# EAGLE schematic ATtiny85 and DRV8830 Combo -- v01 (EAGLE 6.5.0)
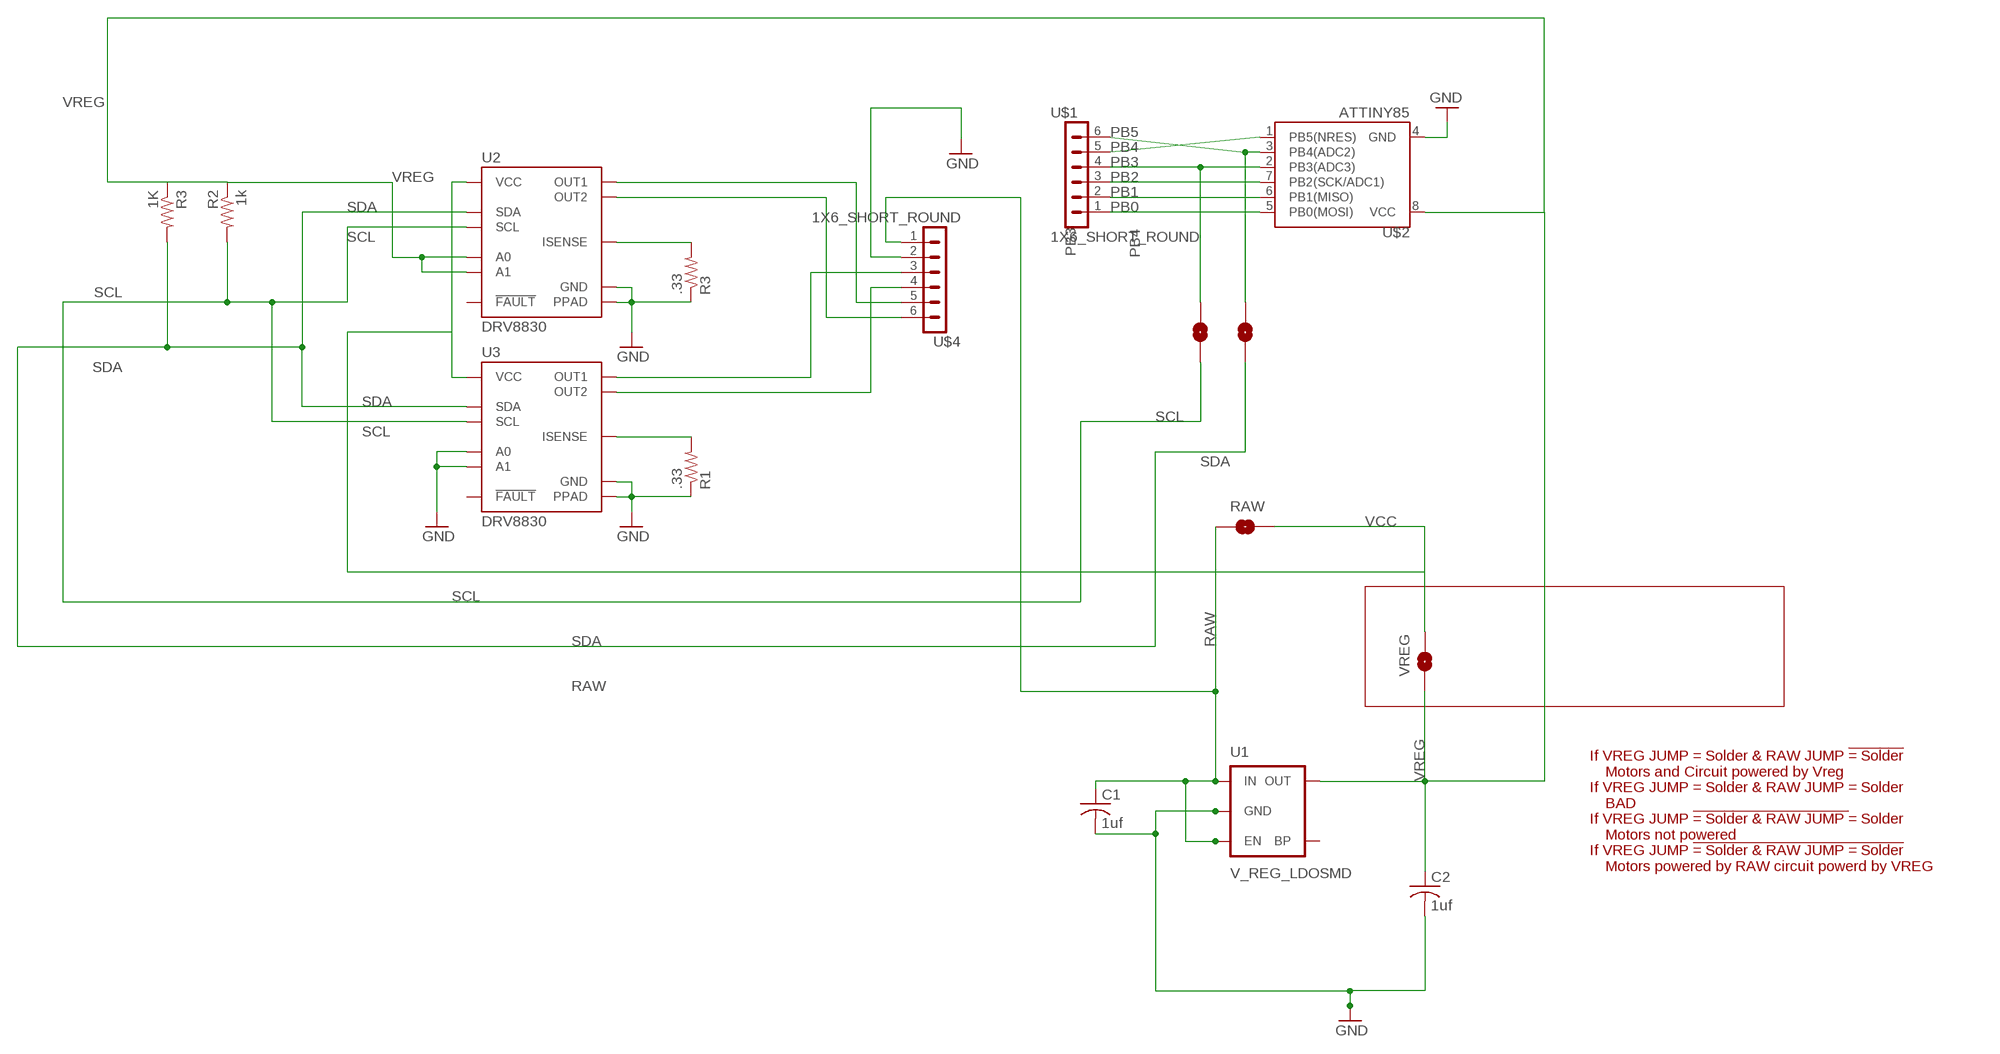
[diagram p0: schematic, sheet 1]

## Parts
1K  R3  R-US_R0402  [R0402]
C1  1uf  C-USC0402  [C0402]
C2  1uf  C-USC0402  [C0402]
R1  .33  R-US_R0402  [R0402]
R2  1k  R-US_R0402  [R0402]
R3  .33  R-US_R0402  [R0402]
RAW  SOLDERJUMPERNO  [SJ_2S-NO]
SJ6  SOLDERJUMPERNO  [SJ_2S-NO]
SJ7  SOLDERJUMPERNO  [SJ_2S-NO]
U1  V_REG_LDOSMD  [SOT23-5]
U2  DRV8830  [MSOP-10-GNDPAD]
U3  DRV8830  [MSOP-10-GNDPAD]
U$1  1X6_SHORT_ROUND  [1X6_SHORT_ROUND]
U$2  ATTINY85  ATTINY45  [SO08-EIAJ]
U$4  1X6_SHORT_ROUND  [1X6_SHORT_ROUND]
VREG  SOLDERJUMPERNO  [SJ_2S-NO]

## Nets
GND: C1.2 C2.2 R1.1 R3.1 U1.2(GND) U2.5(GND) U2.GND(PPAD) U3.5(GND) U3.7(A0) U3.8(A1) U3.GND(PPAD) U$2.4(GND) U$4.2
N$1: R1.2 U3.2(ISENSE)
N$2: R3.2 U2.2(ISENSE)
N$3: U2.3(OUT1) U$4.5
N$4: U2.1(OUT2) U$4.6
N$5: U3.1(OUT2) U$4.4
N$6: U3.3(OUT1) U$4.3
PB0: U$1.1 U$2.5(PB0(MOSI))
PB1: U$1.2 U$2.6(PB1(MISO))
PB2: U$1.3 U$2.7(PB2(SCK/ADC1))
PB3: SJ7.2 U$1.4 U$2.2(PB3(ADC3))
PB4: SJ6.2 U$1.6 U$2.3(PB4(ADC2))
PB5: U$1.5 U$2.1(PB5(NRES))
RAW: C1.1 RAW.1 U1.1(IN) U1.3(EN) U$4.1
SCL: R2.2 SJ7.1 U2.10(SCL) U3.10(SCL)
SDA: 1K.2 SJ6.1 U2.9(SDA) U3.9(SDA)
VCC: RAW.2 U2.4(VCC) U3.4(VCC) VREG.2
VREG: 1K.1 C2.1 R2.1 U1.5(OUT) U2.7(A0) U2.8(A1) U$2.8(VCC) VREG.1
Unconnected: U1.4(BP) U2.6(!FAULT) U3.6(!FAULT)

## Notes on the sheet
- If VREG JUMP = Solder & RAW JUMP != Solder
      Motors and Circuit powered by Vreg
  If VREG JUMP = Solder & RAW JUMP = Solder
      BAD
  If VREG JUMP != Solder & RAW JUMP != Solder
      Motors not powered
  If VREG JUMP != Solder & RAW JUMP = Solder
      Motors powered by RAW circuit powerd by VREG

## Library data of the parts
1K R1-R3 = resistor:R-US_: RESISTOR, American symbol
C1 C2 = resistor:C-US: CAPACITOR, American symbol
RAW SJ6 SJ7 VREG = SparkFun:SOLDERJUMPER: Solder Jumper Standard SMD solder jumper. Used to automate production. Two varients : Normally Open and Normally Closed are the same, but have different paste layers. NC will have a large amount of paste and should jumper during reflow.
U1 = SparkFun:V_REG_LDO: Voltage Regulator LDO Standard 150mA LDO voltage regulator in SOT-23 layout. Micrel part MIC5205. BP (by-pass) pin is used to lower output noise with 470pF cap.
U2 U3 = SparkFun-PowerIC:DRV8830: DRV8830 I2C DC Motor Driver TSSOP-10 with exposed power pad 1A current limit, 2.75V to 6.8V; PROD_ID: IC-11646
U$1 U$4 = Random parts(01-14-14):1X6_SHORT_ROUND
U$2 = SparkFun:ATTINY45: Atmel ATTiny45